# Altium schematic sheet NEB_BYTEBLASTER_INT.SchDoc: ByteBlaster Parallel Port Interface
size A4; CompanyName: Altium; DrawnBy: Ch.W.; Organization: Altium Limited; Address1: L3, 12a Rodborough Rd; Address2: Frenchs Forest; Address3: NSW; Address4: Australia 2086; DocumentNumber: 5; Revision: V0.9; SheetNumber: 5; SheetTotal: 10
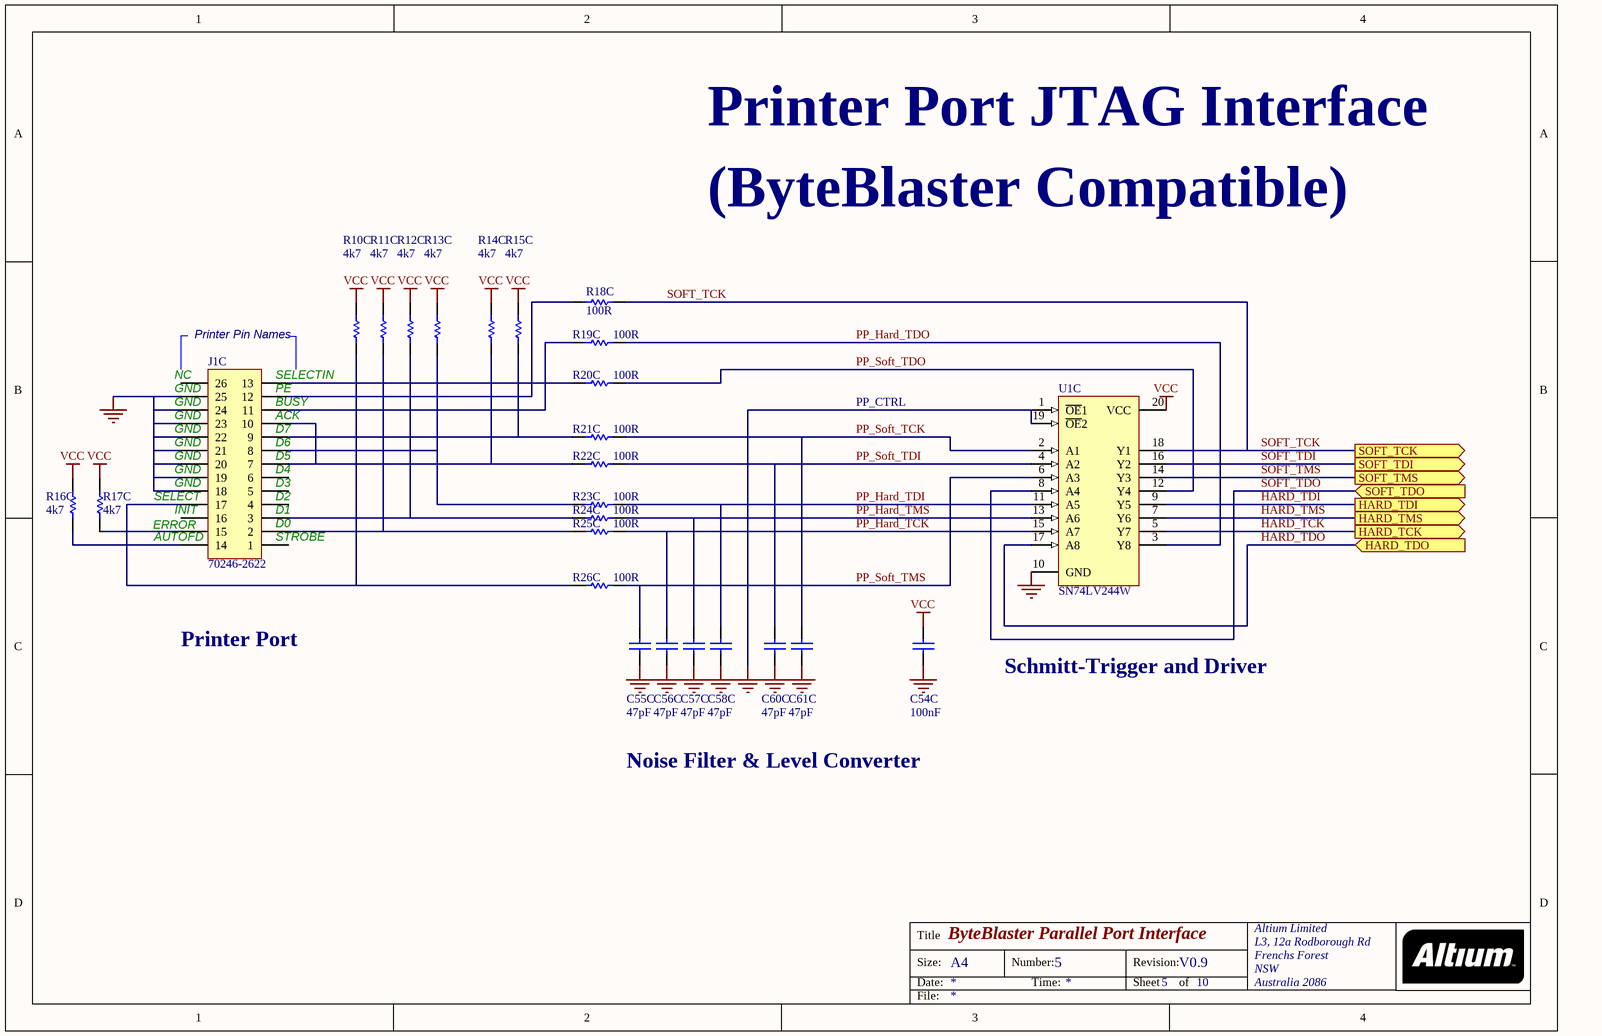
[diagram p0: NEB_BYTEBLASTER_INT.SchDoc]

## Parts
C54C  100nF  [CC2012-0805]
C55C  47pF  [CC2012-0805]
C56C  47pF  [CC2012-0805]
C57C  47pF  [CC2012-0805]
C58C  47pF  [CC2012-0805]
C60C  47pF  [CC2012-0805]
C61C  47pF  [CC2012-0805]
J1C  70246-2622  [HDR2X13_CEN_LP]
R10C  4k7  [CC2012-0805]
R11C  4k7  [CR2012-0805]
R12C  4k7  [CR2012-0805]
R13C  4k7  [CR2012-0805]
R14C  4k7  [CR2012-0805]
R15C  4k7  [CR2012-0805]
R16C  4k7  [CR2012-0805]
R17C  4k7  [CR2012-0805]
R18C  100R  [CC2012-0805]
R19C  100R  [CR2012-0805]
R20C  100R  [CR2012-0805]
R21C  100R  [CR2012-0805]
R22C  100R  [CR2012-0805]
R23C  100R  [CR2012-0805]
R24C  100R  [CR2012-0805]
R25C  100R  [CR2012-0805]
R26C  100R  [CR2012-0805]
U1C  SN74LV244W  [SSO-G20/P.65]

## Ports
HARD_TCK (out), HARD_TDI (out), HARD_TDO (in), HARD_TMS (out), SOFT_TCK (out), SOFT_TDI (out), SOFT_TDO (in), SOFT_TMS (out)

## Nets
GND: C54C.2 C55C.2 C56C.2 C57C.2 C58C.2 C60C.2 C61C.2 J1C.18 J1C.19 J1C.20 J1C.21 J1C.22 J1C.23 J1C.24 J1C.25 U1C.1(~{OE}1) U1C.10(GND) U1C.19(~{OE}2)
VCC: C54C.1 R10C.1 R11C.1 R12C.1 R13C.1 R14C.1 R15C.1 R16C.1 R17C.1 U1C.20(VCC)
HARD_TCK: U1C.5(Y7) ; port HARD_TCK
HARD_TDI: U1C.9(Y5) ; port HARD_TDI
HARD_TDO: U1C.17(A8) ; port HARD_TDO
HARD_TMS: U1C.7(Y6) ; port HARD_TMS
PP_Hard_TCK: C56C.1 R25C.1 U1C.15(A7)
PP_Hard_TDI: C58C.1 R23C.1 U1C.11(A5)
PP_Hard_TDO: R19C.1 U1C.3(Y8)
PP_Hard_TMS: C57C.1 R24C.1 U1C.13(A6)
PP_Soft_TCK: C61C.1 R21C.1 U1C.2(A1)
PP_Soft_TDI: C60C.1 R22C.1 U1C.4(A2)
PP_Soft_TDO: R20C.1 U1C.12(Y4)
PP_Soft_TMS: C55C.1 R26C.1 U1C.6(A3)
SOFT_TCK: R18C.2 U1C.18(Y1) ; port SOFT_TCK
SOFT_TDI: U1C.16(Y2) ; port SOFT_TDI
SOFT_TDO: U1C.8(A4) ; port SOFT_TDO
SOFT_TMS: U1C.14(Y3) ; port SOFT_TMS
NetJ1C_2: J1C.2 R11C.2 R25C.2
NetJ1C_3: J1C.3 R12C.2 R24C.2
NetJ1C_7: J1C.7 J1C.10 R14C.2 R22C.2
NetJ1C_8: J1C.8 R13C.2 R23C.2
NetJ1C_9: J1C.9 R15C.2 R21C.2
NetJ1C_11: J1C.11 R19C.2
NetJ1C_12: J1C.12 R18C.1
NetJ1C_13: J1C.13 R20C.2
NetJ1C_14: J1C.14 R16C.2
NetJ1C_15: J1C.15 R17C.2
NetJ1C_17: J1C.17 R10C.2 R26C.2

Not connected (* = marked no-connect by the designer): J1C 1 4 5 6 16 26

## Notes on the sheet
- Printer Port JTAG Interface
- (ByteBlaster Compatible)
- (near J1C) NC
- Printer Pin Names
- (near J1C) SELECTIN
- (near J1C) GND
- (near J1C) PE
- (near J1C) BUSY
- (near J1C) ACK
- (near J1C) D6
- (near J1C) D7
- PP_CTRL
- (near J1C) SELECT
- (near J1C) INIT
- (near J1C) D1
- (near J1C) D2
- (near J1C) D3
- (near J1C) D4
- (near J1C) D5
- (near J1C) ERROR
- (near J1C) AUTOFD
- (near J1C) STROBE
- (near J1C) D0
- Printer Port
- Schmitt-Trigger and Driver
- Noise Filter & Level Converter
- Title
- Size:
- Date:
- A4
- Number:
- Time:
- Revision:
- Sheet
- of
- File:

## Library data of the parts
C54C C55C C56C C57C C58C C60C C61C = CAP: Capacitor; Fitted: True; Supplier: FARNELL; Supplier Code: 755-552
J1C = Header 13X2A: Header, 13-Pin, Dual row; Manufacturer: Generic Components; Class I: Connector; Fitted: True; Revision: July-2002: Re-released for DXP Platform.; Publisher: Altium Limited
R10C R11C R12C R13C R14C R15C R16C R17C R19C R20C R21C R22C R23C R24C R25C R26C = RES: Resistor; Fitted: True
R18C = RES: Resistor
U1C = SN54LV244W: Octal Buffer/Driver with 3-State Outputs; Package Information: Latest Revision: Jan-1995; Published: 8-Jun-2000; Revision: 17-Jul-2002: Re-released for DXP Platform.; Datasheet: Latest Revision: Apr-1996; Package Reference: W020; Publisher: Altium Limited